# EAGLE design imu_3_xz (EAGLE 4.15)
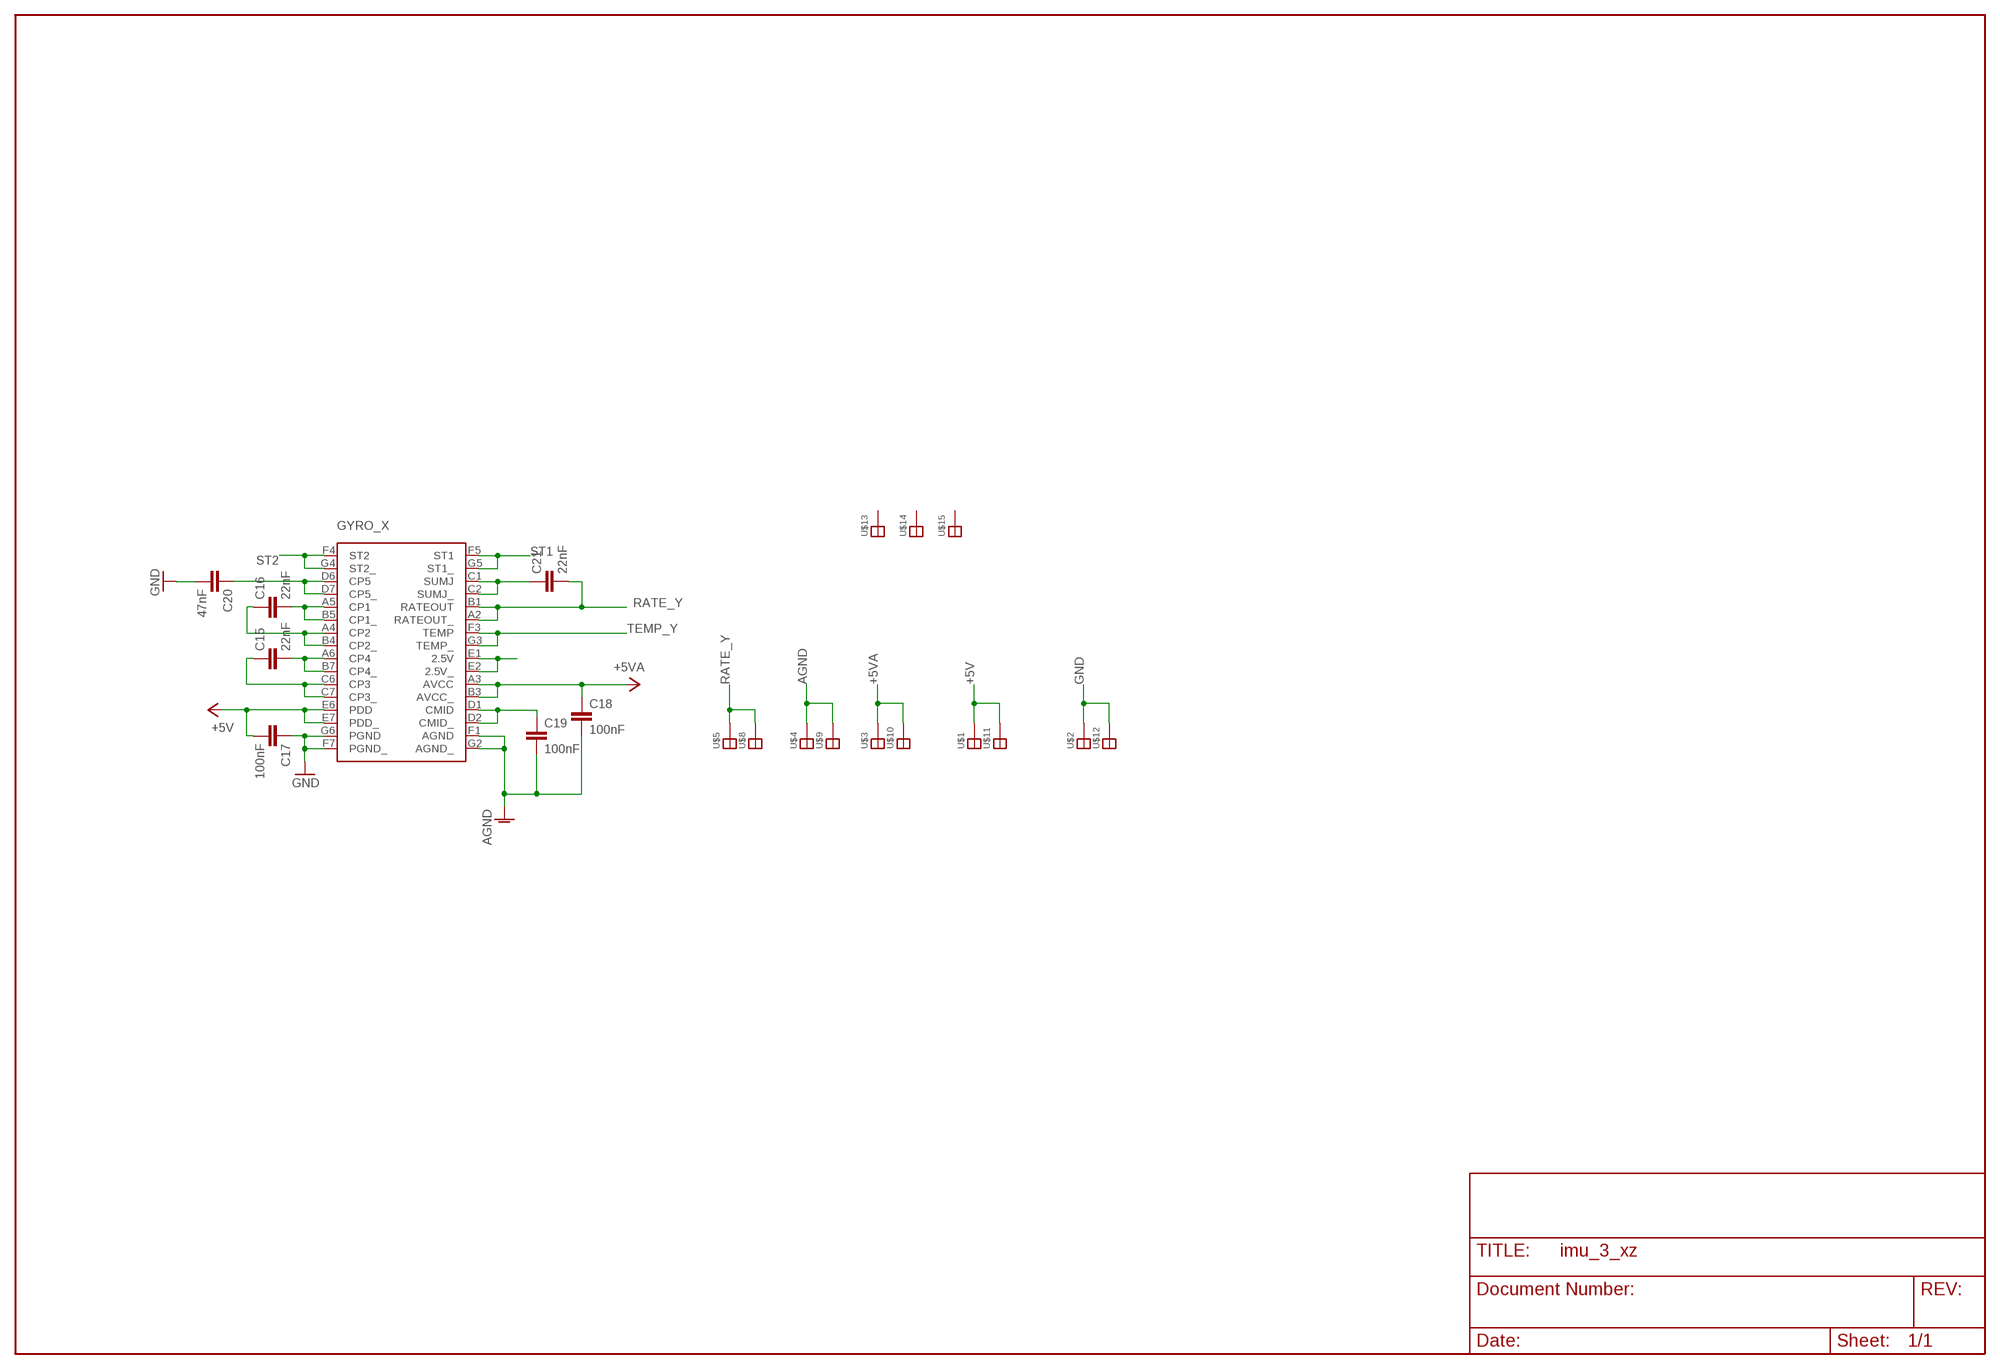
[diagram p0: schematic, sheet 1]

## Parts
C15  22nF  C-EUC0402K  [C0402K]
C16  22nF  C-EUC0402K  [C0402K]
C17  100nF  C-EUC0402K  [C0402K]
C18  100nF  C-EUC0402K  [C0402K]
C19  100nF  C-EUC0402K  [C0402K]
C20  47nF  C-EUC0402K  [C0402K]
C21  22nF  C-EUC0402K  [C0402K]
GYRO_X  ADXR  [BC-32]
U$1  SOLDER_PAD  [SOLDER_PAD]
U$2  SOLDER_PAD  [SOLDER_PAD]
U$3  SOLDER_PAD  [SOLDER_PAD]
U$4  SOLDER_PAD  [SOLDER_PAD]
U$5  SOLDER_PAD  [SOLDER_PAD]
U$8  SOLDER_PAD  [SOLDER_PAD]
U$9  SOLDER_PAD  [SOLDER_PAD]
U$10  SOLDER_PAD  [SOLDER_PAD]
U$11  SOLDER_PAD  [SOLDER_PAD]
U$12  SOLDER_PAD  [SOLDER_PAD]
U$13  SOLDER_PAD  [SOLDER_PAD]
U$14  SOLDER_PAD  [SOLDER_PAD]
U$15  SOLDER_PAD  [SOLDER_PAD]

## Nets
+5V: C17.2 GYRO_X.E6(PDD) GYRO_X.E7(PDD_) U$1.P$1 U$11.P$1
+5VA: C18.1 GYRO_X.A3(AVCC) GYRO_X.B3(AVCC_) U$3.P$1 U$10.P$1
AGND: C18.2 C19.2 GYRO_X.F1(AGND) GYRO_X.G2(AGND_) U$4.P$1 U$9.P$1
GND: C17.1 C20.2 GYRO_X.F7(PGND_) GYRO_X.G6(PGND) U$2.P$1 U$12.P$1
N$6: C21.1 GYRO_X.C1(SUMJ) GYRO_X.C2(SUMJ_)
N$7: C15.1 GYRO_X.C6(CP3) GYRO_X.C7(CP3_)
N$11: C20.1 GYRO_X.D6(CP5) GYRO_X.D7(CP5_)
N$12: C16.2 GYRO_X.A5(CP1) GYRO_X.B5(CP1_)
N$13: C16.1 GYRO_X.A4(CP2) GYRO_X.B4(CP2_)
N$14: C15.2 GYRO_X.A6(CP4) GYRO_X.B7(CP4_)
N$17: GYRO_X.E1(2.5V) GYRO_X.E2(2.5V_)
N$19: C19.1 GYRO_X.D1(CMID) GYRO_X.D2(CMID_)
RATE_Y: C21.2 GYRO_X.A2(RATEOUT_) GYRO_X.B1(RATEOUT) U$5.P$1 U$8.P$1
ST1: GYRO_X.F5(ST1) GYRO_X.G5(ST1_)
ST2: GYRO_X.F4(ST2) GYRO_X.G4(ST2_)
TEMP_Y: GYRO_X.F3(TEMP) GYRO_X.G3(TEMP_)
Unconnected: U$13.P$1 U$14.P$1 U$15.P$1

## Library data of the parts
C15-C21 = rcl:C-EU: CAPACITOR, European symbol
GYRO_X = paparazzi:ADXR
U$1-U$5 U$8-U$15 = paparazzi:SOLDER_PAD

## Board
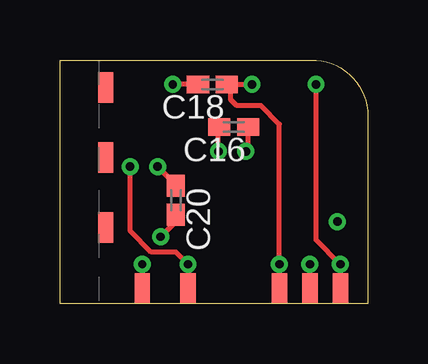
[diagram p1: board, top side]
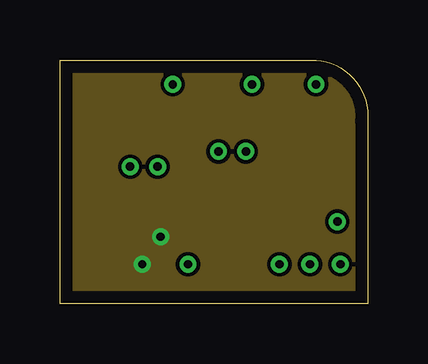
[diagram p2: board, inner layer Route2]
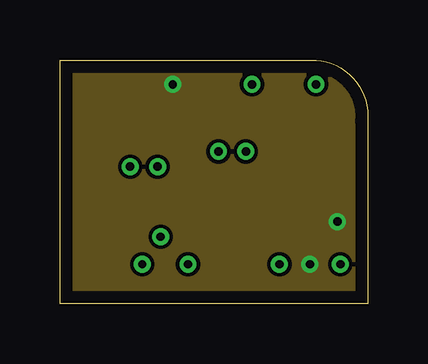
[diagram p3: board, inner layer Route15]
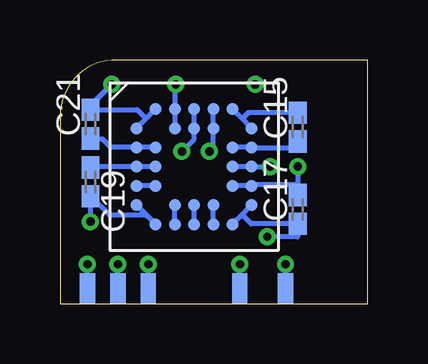
[diagram p4: board, bottom side, seen from below]

Size 12.83 x 10.16 mm. Coordinates in mm from the lower left corner, seen from the top.
Outline: 0,10.15 0,0 12.82,0 12.82,7.62 arc90 10.67,10.16 0.01,10.16
Copper layers (1*2+15*16): Top 0.035mm / dielectric 0.2mm / Route2 0.035mm / dielectric 1.5mm / Route15 0.035mm / dielectric 0.2mm / Bottom 0.035mm
Design rules "eurocircuits_verified_4l": minimum track width 0.15mm, minimum drill 0.35mm, track to track 0.15mm, track to pad 0.15mm, pad to pad 0.15mm, via to via 0.15mm, smd to smd 0.15mm, copper to edge 20mil, drill to drill 8mil, minimum pad ring 10mil, minimum via ring 7mil, stop-mask expansion 4mil, vias tented up to drill 0mil, thermal gap 10mil

### Footprints (pad centres in the part's own frame; a part is rotated, then mirrored left to right if it is on the bottom)
C0402K = smd 0.925 x 0.74: 1 -0.6,0; 2 0.6,0
BC-32 = smd 0.5 x 0.5: A2 -1.6,2.4; A3 -0.8,2.4; A4 0,2.4; A5 0.8,2.4; A6 1.6,2.4; B1 -2.4,1.6; B3 -0.8,1.6; B4 0,1.6; B5 0.8,1.6; B7 2.4,1.6; C1 -2.4,0.8; C2 -1.6,0.8; C6 1.6,0.8; C7 2.4,0.8; D1 -2.4,0; D2 -1.6,0; D6 1.6,0; D7 2.4,0; E1 -2.4,-0.8; E2 -1.6,-0.8; E6 1.6,-0.8; E7 2.4,-0.8; F1 -2.4,-1.6; F3 -0.8,-1.6; F4 0,-1.6; F5 0.8,-1.6; F7 2.4,-1.6; G2 -1.6,-2.4; G3 -0.8,-2.4; G4 0,-2.4; G5 0.8,-2.4; G6 1.6,-2.4
SOLDER_PAD = smd 0.635 x 1.27: P$1 0,0

### Placement (x,y rotation side)
C15  2.92,7.37 90 bottom
C16  7.24,7.37 180 top
C17  2.92,3.94 90 bottom
C18  6.35,9.14 180 top
C19  11.56,5.08 270 bottom
C20  4.83,4.32 270 top
C21  11.56,7.49 90 bottom
GYRO_X  7.24,5.72 0 bottom
U$1  5.33,0.64 180 top
U$2  3.43,0.64 180 top
U$3  9.14,0.64 180 top
U$4  10.41,0.64 180 top
U$5  11.68,0.64 180 top
U$8  11.68,0.64 0 bottom
U$9  10.41,0.64 0 bottom
U$10  9.14,0.64 0 bottom
U$11  5.33,0.64 0 bottom
U$12  3.43,0.64 0 bottom
U$13  1.91,9.02 0 top
U$14  1.91,3.17 0 top
U$15  1.91,6.1 0 top

### Tracks (layer width: path | path; a pad name or v marks a point on that pad's centre or on a via)
+5V  (via drill 0.35)
  Top 0.203: U$11.P$1 v5.33,1.65 4.83,2.16 3.81,2.16 2.92,3.05 v2.92,5.72
  Bottom 0.203: 4.84,4.94 4.83,4.95 2.92,4.95 | 4.84,4.94 GYRO_X.E7 | GYRO_X.E6 4.86,4.92 4.84,4.94 | U$11.P$1 v5.33,1.65 | v2.92,5.72 2.92,4.95 | 2.92,4.95 C17.2
+5VA  (via drill 0.35)
  Top 0.203: U$10.P$1 v9.14,1.65 9.14,7.49 8.38,8.25 7.37,8.25 7.11,8.51 7.11,9.14 | 7.11,9.14 v8,9.14 | 7.11,9.14 C18.1
  Bottom 0.203: U$10.P$1 v9.14,1.65 | 8.01,8.11 8,8.13 | 8.01,8.11 GYRO_X.A3 8.04,9.11 v8,9.14 | GYRO_X.B3 8.04,8.09 8.01,8.11
AGND  (via drill 0.35)
  Top 0.203: v10.41,1.65 U$9.P$1 | C18.2 v4.7,9.14
  Bottom 0.203: GYRO_X.F1 9.65,4.1 9.65,4.06 9.59,4.06 9.24,3.71 | GYRO_X.G2 9.24,3.71 | 9.24,3.71 9.27,3.68 10.76,3.68 C19.2 v11.56,3.43 | U$9.P$1 v10.41,1.65
  pour Route15: 0,0 12.83,0 12.83,10.16 0,10.16
GND  (via drill 0.35)
  Top 0.203: v3.43,1.65 U$12.P$1 | v4.19,2.79 4.83,3.43 C20.2
  Bottom 0.203: GYRO_X.F7 4.83,4.1 4.83,4.06 4.89,4.06 5.24,3.71 | 5.24,3.71 GYRO_X.G6 | U$12.P$1 v3.43,1.65 | 5.24,3.71 4.86,3.34 C17.1 2.92,2.79 v4.19,2.79
  pour Route2: 12.83,10.16 0,10.16 0,0 12.83,0
N$6
  Bottom 0.203: GYRO_X.C2 GYRO_X.C1 | GYRO_X.C1 9.65,6.51 9.65,6.48 | GYRO_X.C1 10.71,6.51 11.05,6.86 11.56,6.86 C21.1
N$7
  Bottom 0.203: 4.84,6.49 4.83,6.48 | 4.84,6.49 GYRO_X.C7 | GYRO_X.C6 4.86,6.51 4.84,6.49 | C15.1 2.92,6.86 3.29,6.49 4.84,6.49
N$11  (via drill 0.35)
  Top 0.203: C20.1 4.83,4.95 v4.06,5.72
  Bottom 0.203: GYRO_X.D6 GYRO_X.D7 v4.06,5.72
N$12  (via drill 0.35)
  Top 0.203: C16.2 6.6,7.33 v6.6,6.35
  Bottom 0.203: 6.46,8.11 6.48,8.13 | 6.46,8.11 GYRO_X.A5 | 6.46,8.11 6.44,8.09 GYRO_X.B5 6.44,6.51 v6.6,6.35
N$13  (via drill 0.35)
  Top 0.203: C16.1 7.84,6.44 v7.75,6.35
  Bottom 0.203: 7.24,8.13 GYRO_X.A4 GYRO_X.B4 7.24,6.86 v7.75,6.35
N$14
  Bottom 0.203: GYRO_X.B7 4.83,7.33 4.83,7.37 4.89,7.37 5.24,7.72 | 5.24,7.72 GYRO_X.A6 | C15.2 4.99,7.97 5.24,7.72
N$17
  Bottom 0.203: GYRO_X.E2 8.8,4.92 | 8.8,4.92 GYRO_X.E1 | 8.8,4.92 8.76,4.95
N$19
  Bottom 0.203: GYRO_X.D1 9.65,5.72 | GYRO_X.D2 GYRO_X.D1 | C19.1 11.56,5.72 GYRO_X.D1
RATE_Y  (via drill 0.35)
  Top 0.203: U$8.P$1 v11.68,1.65 10.67,2.67 v10.67,9.14
  Bottom 0.203: U$8.P$1 v11.68,1.65 | GYRO_X.A2 8.85,8.13 8.89,8.13 8.89,8.06 9.24,7.72 | 9.24,7.72 GYRO_X.B1 | 9.24,7.72 9.62,8.09 C21.2 11.56,8.25 v10.67,9.14
ST1
  Bottom 0.203: 6.46,3.32 6.48,3.3 | GYRO_X.G5 6.46,3.32 | GYRO_X.F5 6.44,3.34 6.46,3.32
ST2
  Bottom 0.203: 7.24,3.3 GYRO_X.G4 GYRO_X.F4
TEMP_Y
  Bottom 0.203: 8.01,3.32 8,3.3 | GYRO_X.G3 8.01,3.32 | GYRO_X.F3 8.04,3.34 8.01,3.32